# EAGLE schematic sram (EAGLE 9.5.1)

## Sheet 1 of 2
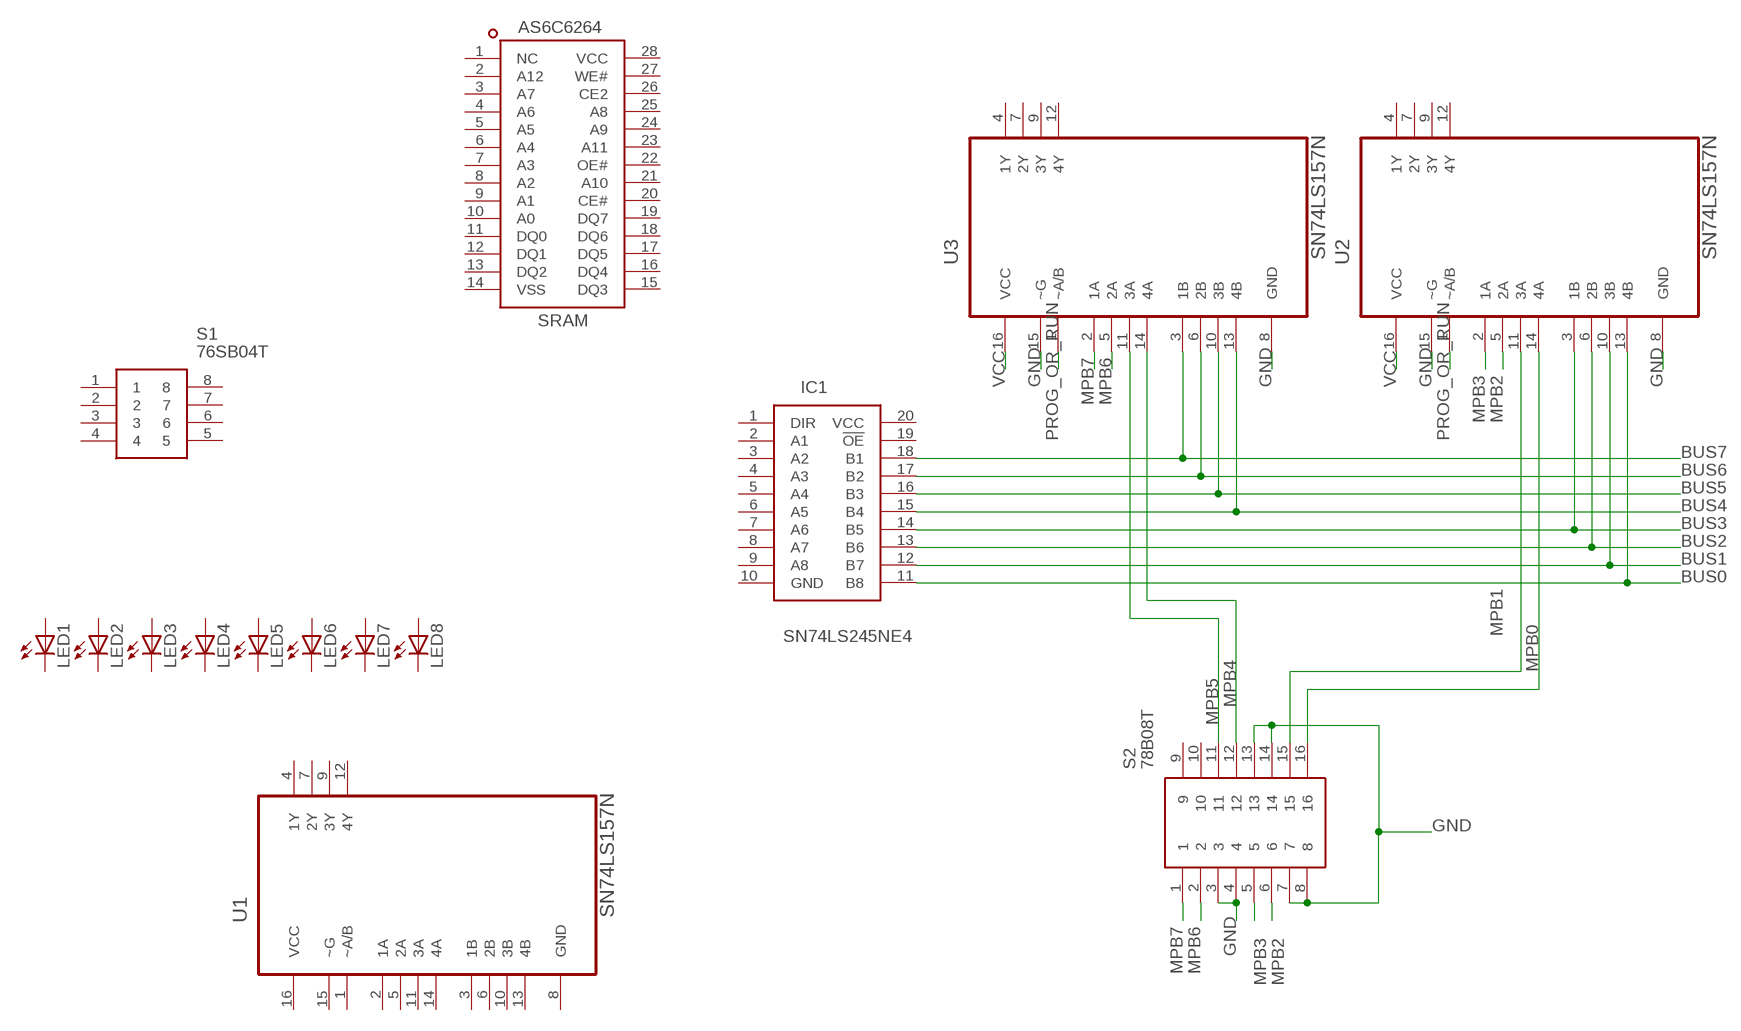
[diagram p0: schematic, sheet 1]

### Parts
IC1  SN74LS245NE4  [DIP794W53P254L2540H508Q20N]
LED1  LED3MM  [LED3MM]
LED2  LED3MM  [LED3MM]
LED3  LED3MM  [LED3MM]
LED4  LED3MM  [LED3MM]
LED5  LED3MM  [LED3MM]
LED6  LED3MM  [LED3MM]
LED7  LED3MM  [LED3MM]
LED8  LED3MM  [LED3MM]
S1  76SB04T  [DIP762W56P250L1220H739Q8N]
S2  78B08T  [78B08T]
U1  SN74LS157N  [DIP254P762X508-16]
U2  SN74LS157N  [DIP254P762X508-16]
U3  SN74LS157N  [DIP254P762X508-16]
U$1  AS6C6264-8KX8BIT-CMOS  [DIP794W46P254L2967H457Q28B]

### Nets
BUS0: IC1.11(B8) U2.13(4B) ; also sheet 2
BUS1: IC1.12(B7) U2.10(3B) ; also sheet 2
BUS2: IC1.13(B6) U2.6(2B) ; also sheet 2
BUS3: IC1.14(B5) U2.3(1B) ; also sheet 2
BUS4: IC1.15(B4) U3.13(4B)
BUS5: IC1.16(B3) U3.10(3B)
BUS6: IC1.17(B2) U3.6(2B)
BUS7: IC1.18(B1) U3.3(1B)
GND: S2.3 S2.4 S2.7 S2.8 S2.13 S2.14 U2.8(GND) U2.15(~G) U3.8(GND) U3.15(~G) ; also sheet 2
MPB0: S2.16 U2.14(4A)
MPB1: S2.15 U2.11(3A)
MPB2: S2.6 U2.5(2A)
MPB3: S2.5 U2.2(1A)
MPB4: S2.12 U3.14(4A)
MPB5: S2.11 U3.11(3A)
MPB6: S2.2 U3.5(2A)
MPB7: S2.1 U3.2(1A)
PROG_OR_RUN: U2.1(~A/B) U3.1(~A/B) ; also sheet 2
VCC: U2.16(VCC) U3.16(VCC) ; also sheet 2
Unconnected: IC1.1(DIR) IC1.2(A1) IC1.3(A2) IC1.4(A3) IC1.5(A4) IC1.6(A5) IC1.7(A6) IC1.8(A7) IC1.9(A8) IC1.10(GND) IC1.19(!OE) IC1.20(VCC) LED1.A LED1.K(C) LED2.A LED2.K(C) LED3.A LED3.K(C) LED4.A LED4.K(C) LED5.A LED5.K(C) LED6.A LED6.K(C) LED7.A LED7.K(C) LED8.A LED8.K(C) S1.1 S1.2 S1.3 S1.4 S1.5 S1.6 S1.7 S1.8 S2.9 S2.10 U1.1(~A/B) U1.2(1A) U1.3(1B) U1.4(1Y) U1.5(2A) U1.6(2B) U1.7(2Y) U1.8(GND) U1.9(3Y) U1.10(3B) U1.11(3A) U1.12(4Y) U1.13(4B) U1.14(4A) U1.15(~G) U2.4(1Y) U2.7(2Y) U2.9(3Y) U2.12(4Y) U3.4(1Y) U3.7(2Y) U3.9(3Y) U3.12(4Y) U$1.1(NC) U$1.2(A12) U$1.3(A7) U$1.4(A6) U$1.5(A5) U$1.6(A4) U$1.7(A3) U$1.8(A2) U$1.9(A1) U$1.10(A0) U$1.11(DQ0) U$1.12(DQ1) U$1.13(DQ2) U$1.15(DQ3) U$1.16(DQ4) U$1.17(DQ5) U$1.18(DQ6) U$1.19(DQ7) U$1.20(CE#) U$1.21(A10) U$1.22(OE#) U$1.23(A11) U$1.24(A9) U$1.25(A8) U$1.26(CE2) U$1.27(WE#)

## Sheet 2 of 2
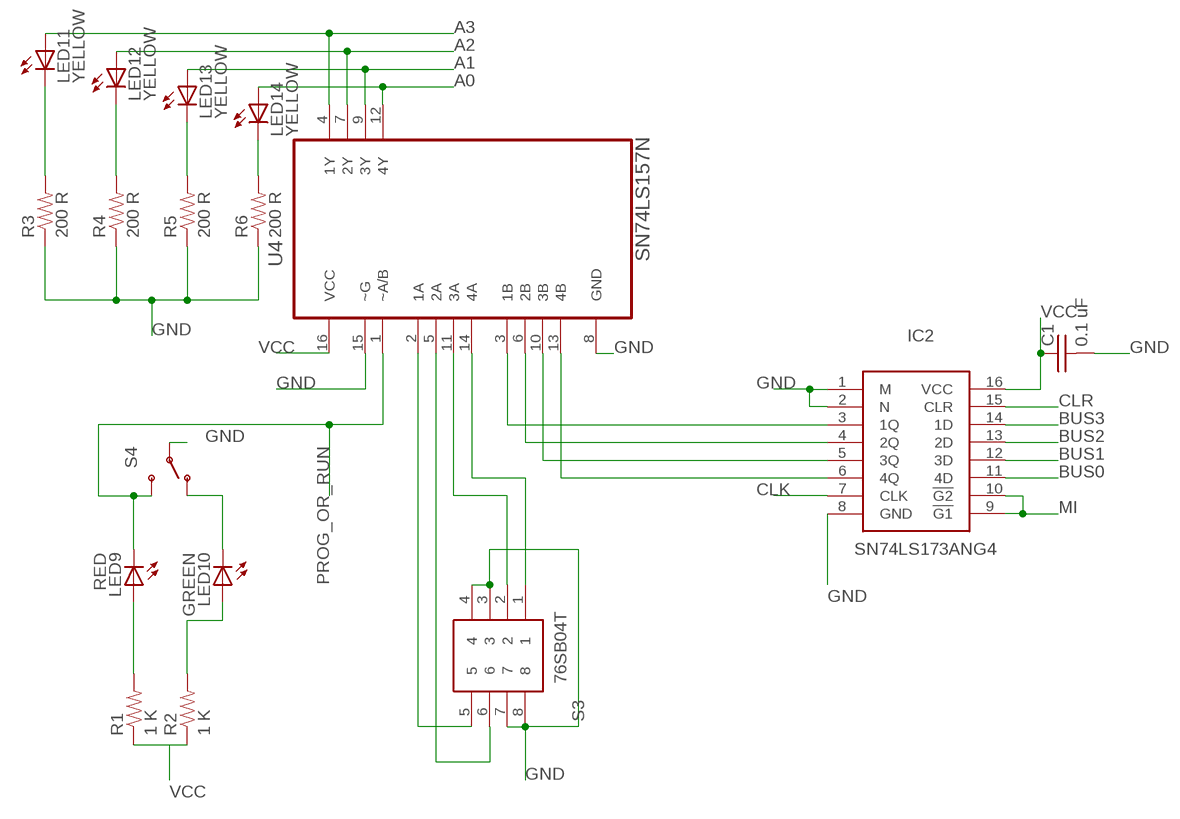
[diagram p1: schematic, sheet 2]

### Parts
C1  0.1 uF  C-USC0805K  [C0805K]
IC2  SN74LS173ANG4  [DIP794W53P254L1930H508Q16N]
LED9  RED  LED3MM  [LED3MM]
LED10  GREEN  LED3MM  [LED3MM]
LED11  YELLOW  LED3MM  [LED3MM]
LED12  YELLOW  LED3MM  [LED3MM]
LED13  YELLOW  LED3MM  [LED3MM]
LED14  YELLOW  LED3MM  [LED3MM]
R1  1 K  RESISTORPTH-1/4W  [AXIAL-0.4]
R2  1 K  RESISTORPTH-1/4W  [AXIAL-0.4]
R3  200 R  RESISTORPTH-1/4W  [AXIAL-0.4]
R4  200 R  RESISTORPTH-1/4W  [AXIAL-0.4]
R5  200 R  RESISTORPTH-1/4W  [AXIAL-0.4]
R6  200 R  RESISTORPTH-1/4W  [AXIAL-0.4]
S3  76SB04T  [DIP762W56P250L1220H739Q8N]
S4  SWITCH-SPSTKIT  [SWITCH-SPDT_KIT]
U4  SN74LS157N  [DIP254P762X508-16]

### Nets
A0: LED14.A U4.12(4Y)
A1: LED13.A U4.9(3Y)
A2: LED12.A U4.7(2Y)
A3: LED11.A U4.4(1Y)
BUS0: IC2.11(4D) ; also sheet 1
BUS1: IC2.12(3D) ; also sheet 1
BUS2: IC2.13(2D) ; also sheet 1
BUS3: IC2.14(1D) ; also sheet 1
CLK: IC2.7(CLK)
CLR: IC2.15(CLR)
GND: C1.2 IC2.1(M) IC2.2(N) IC2.8(GND) R3.P$1 R4.P$1 R5.P$1 R6.P$1 S3.3 S3.4 S3.7 S3.8 S4.2(P) U4.8(GND) U4.15(~G) ; also sheet 1
MI: IC2.9(!G1) IC2.10(!G2)
N$1: S3.5 U4.2(1A)
N$2: LED9.A R1.P$2
N$3: LED10.A R2.P$2
N$4: LED10.K(C) S4.1(O)
N$6: S3.6 U4.5(2A)
N$7: S3.2 U4.11(3A)
N$8: S3.1 U4.14(4A)
N$9: IC2.3(1Q) U4.3(1B)
N$10: IC2.4(2Q) U4.6(2B)
N$11: IC2.5(3Q) U4.10(3B)
N$12: IC2.6(4Q) U4.13(4B)
N$13: LED11.K(C) R3.P$2
N$14: LED12.K(C) R4.P$2
N$15: LED13.K(C) R5.P$2
N$16: LED14.K(C) R6.P$2
PROG_OR_RUN: LED9.K(C) S4.3(S) U4.1(~A/B) ; also sheet 1
VCC: C1.1 IC2.16(VCC) R1.P$1 R2.P$1 U4.16(VCC) ; also sheet 1

## Power pins joined to a net without a drawn wire
VCC: U1.16(VCC) U$1.28(VCC)
VSS: U$1.14(VSS)

## Library data of the parts
C1 = passives:C-US: CAPACITOR, American symbol
IC1 = ICs:SN74LS245NE4: Bus Transceivers Octal bus Transceiver Source: Datasheet <http://www.ti.com/lit/ds/symlink/sn74ls245.pdf>; DESCRIPTION: Bus Transceivers Octal bus Transceiver; HEIGHT: 5.08mm; MANUFACTURER_NAME: Texas Instruments; MANUFACTURER_PART_NUMBER: SN74LS245NE4; MOUSER_PART_NUMBER: 595-SN74LS245NE4; MOUSER_PRICE-STOCK: https://www.mouser.com/Search/Refine.aspx?Keyword=595-SN74LS245NE4
IC2 = ICs:SN74LS173ANG4: IC D-TYPE POS TRG SNGL 16DIP Source: Datasheet <http://www.ti.com/lit/ds/symlink/sn74ls173a.pdf>; DESCRIPTION: IC D-TYPE POS TRG SNGL 16DIP; HEIGHT: 5.08mm; MANUFACTURER_NAME: Texas Instruments; MANUFACTURER_PART_NUMBER: SN74LS173ANG4
LED1-LED14 = leds:LED: LEDs Standard schematic elements and footprints for 5mm, 3mm, 1206, and 0603 sized LEDs. 5mm - Spark Fun Electronics SKU : COM-00529 (and others)
R1-R6 = passives:RESISTOR: Resistor Basic schematic elements and footprints for 0603, 1206, and PTH resistors.
S1 S3 = switches:76SB04T: Dip Switch Source: Datasheet <https://componentsearchengine.com/Datasheets/1/76SB04T.pdf>; DESCRIPTION: Dip Switch; HEIGHT: 7.39mm; MANUFACTURER_NAME: Grayhill; MANUFACTURER_PART_NUMBER: 76SB04T; MOUSER_PART_NUMBER: 706-76SB04T; MOUSER_PRICE-STOCK: https://www.mouser.com/Search/Refine.aspx?Keyword=706-76SB04T
S2 = switches:78B08T: Switch DIP OFF ON SPST 8 Raised Slide 0.15A 30VDC PC Pins 2000Cycles/SwitchCycles 2.54mm Thru-Hole Tube Source: Datasheet <https://componentsearchengine.com/Datasheets/1/78B08T.pdf>; DESCRIPTION: Switch DIP OFF ON SPST 8 Raised Slide 0.15A 30VDC PC Pins 2000Cycles/SwitchCycles 2.54mm Thru-Hole Tube; HEIGHT: 7.49mm; MANUFACTURER_NAME: Grayhill; MANUFACTURER_PART_NUMBER: 78B08T; MOUSER_PART_NUMBER: 706-78B08T; MOUSER_PRICE-STOCK: https://www.mouser.com/Search/Refine.aspx?Keyword=706-78B08T
S4 = switches:SWITCH-SPST: SPST Switch Simple slide switch.
U1-U4 = ICs:SN74LS157N: MULTIPLEXERS; AVAILABILITY: Unavailable; DESCRIPTION: IC Quad 2-1 L Data/sel 16PI; MF: Texas Instruments; MP: SN74LS157N; PACKAGE: PDIP-16 Motorola; PRICE: None
U$1 = ICs:AS6C6264-8KX8BIT-CMOS